# EAGLE design Osmofl2k_adapter_bandpass (EAGLE 7.5.0)
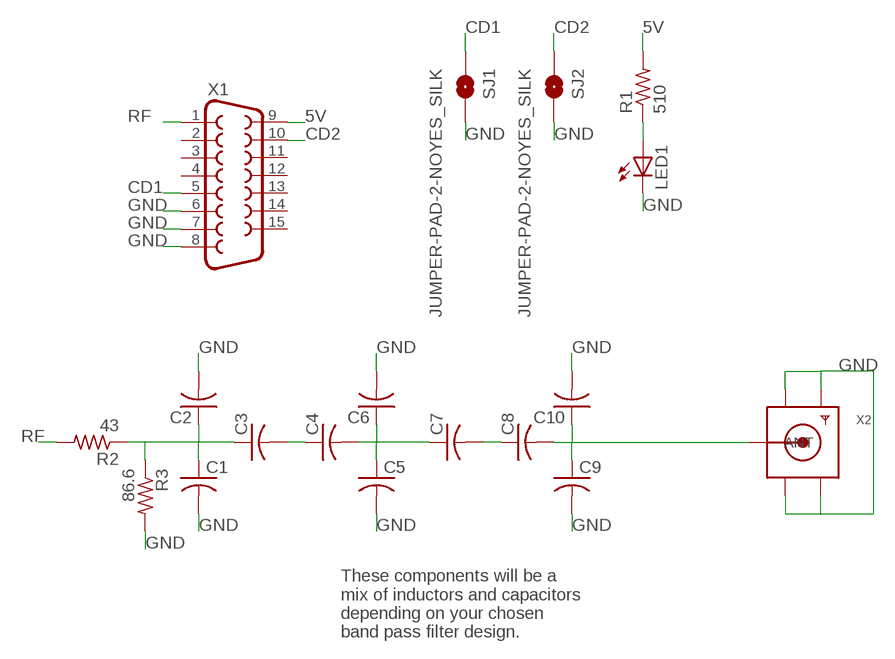
[diagram p0: schematic, sheet 1]

## Parts
C1  C-USC0603  [C0603]
C2  C-USC0402  [C0402]
C3  C-USC0805  [C0805]
C4  C-USC0603  [C0603]
C5  C-USC0603  [C0603]
C6  C-USC0402  [C0402]
C7  C-USC0805  [C0805]
C8  C-USC0603  [C0603]
C9  C-USC0603  [C0603]
C10  C-USC0402  [C0402]
LED1  LEDCHIPLED_0805  [CHIPLED_0805]
R1  510  R-US_R0805  [R0805]
R2  43  R-US_R0805  [R0805]
R3  86.6  R-US_R0805  [R0805]
SJ1  JUMPER-PAD-2-NOYES_SILK  [PAD-JUMPER-2-NO_YES_SILK]
SJ2  JUMPER-PAD-2-NOYES_SILK  [PAD-JUMPER-2-NO_YES_SILK]
X1  F15HDH  [HDF15H]
X2  SMACONNECTOR_EDGE  [SMA_EDGELAUNCH]

## Nets
5V: R1.2 X1.9
CD1: SJ1.1 X1.5
CD2: SJ2.1 X1.10
GND: C1.2 C2.2 C5.2 C6.2 C9.2 C10.2 LED1.C R3.2 SJ1.2 SJ2.2 X1.6 X1.7 X1.8 X2.GND@1(GND4) X2.GND@2(GND3) X2.GND@3(GND2) X2.GND@4(GND1)
N$1: C4.2 C5.1 C6.1 C7.1
N$2: LED1.A R1.1
N$3: C3.2 C4.1
N$4: C1.1 C2.1 C3.1 R2.1 R3.1
N$7: C7.2 C8.1
N$8: C8.2 C9.1 C10.1 X2.P(ANT)
RF: R2.2 X1.1
Unconnected: X1.2 X1.3 X1.4 X1.11 X1.12 X1.13 X1.14 X1.15

## Notes on the sheet
- These components will be a
  mix of inductors and capacitors
  depending on your chosen
  band pass filter design.

## Library data of the parts
C1-C10 = adafruit:C-US: CAPACITOR, American symbol
LED1 = adafruit:LED: LED OSRAM: - CHIPLED LG R971, LG N971, LY N971, LG Q971, LY Q971, LO R971, LY R971 LH N974, LH R974 LS Q976, LO Q976, LY Q976 LO Q996 - Hyper CHIPLED LW Q18S LB Q993, LB Q99A, LB R99A - SideLED LS A670, LO A670, LY A670, LG A670, LP A670 LB A673, LV A673, LT A673, LW A673 LH A674 LY A675 LS A676, LA A676, LO A676, LY A676, LW A676 LS A679, LY A679, LG A679 - Hyper Micro SIDELED® LS Y876, LA Y876, LO Y876, LY Y876 LT Y87S - SmartLED LW L88C, LW L88S LB L89C, LB L89S, LG L890 LS L89K, LO L89K, LY L89K LS L896, LA L896, LO L896, LY L896 - TOPLED LS T670, LO T670, LY T670, LG T670, LP T670 LSG T670, LSP T670, LSY T670, LOP T670, LYG T670 LG T671, LOG T671, LSG T671 LB T673, LV T673, LT T673, LW T673 LH T674 LS T676, LA T676, LO T676, LY T676, LB T676, LH T676, LSB T676, LW T676 LB T67C, LV T67C, LT T67C, LS T67K, LO T67K, LY T67K, LW E67C LS E67B, LA E67B, LO E67B, LY E67B, LB E67C, LV E67C, LT E67C LW T67C LS T679, LY T679, LG T679 LS T770, LO T770, LY T770, LG T770, LP T770 LB T773, LV T773, LT T773, LW T773 LH T774 LS E675, LA E675, LY E675, LS T675 LS T776, LA T776, LO T776, LY T776, LB T776 LHGB T686 LT T68C, LB T68C - Hyper Mini TOPLED® LB M676 - Mini TOPLED Santana® LG M470 LS M47K, LO M47K, LY M47K Source: http://www.osram.convergy.de/
R1-R3 = adafruit:R-US_: RESISTOR, American symbol
SJ1 SJ2 = SparkFun-Passives:JUMPER-PAD-2-NO
X1 = adafruit:F15: SUB-D HDH is also known as a 'right angle VGA' connector
X2 = adafruit:SMACONNECTOR: SMA Connector 90° DIP SMA Connector, 50 Ohm (4UConnector: 07259)

## Board
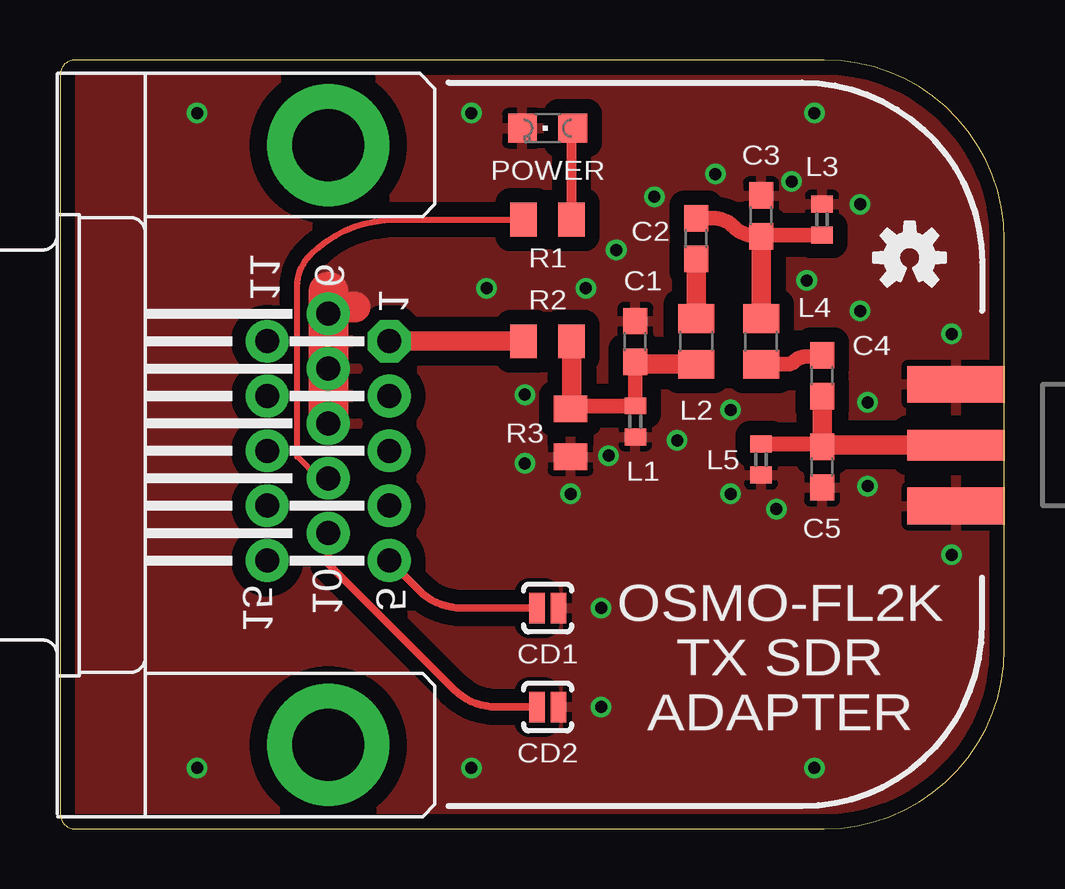
[diagram p1: board, top side]
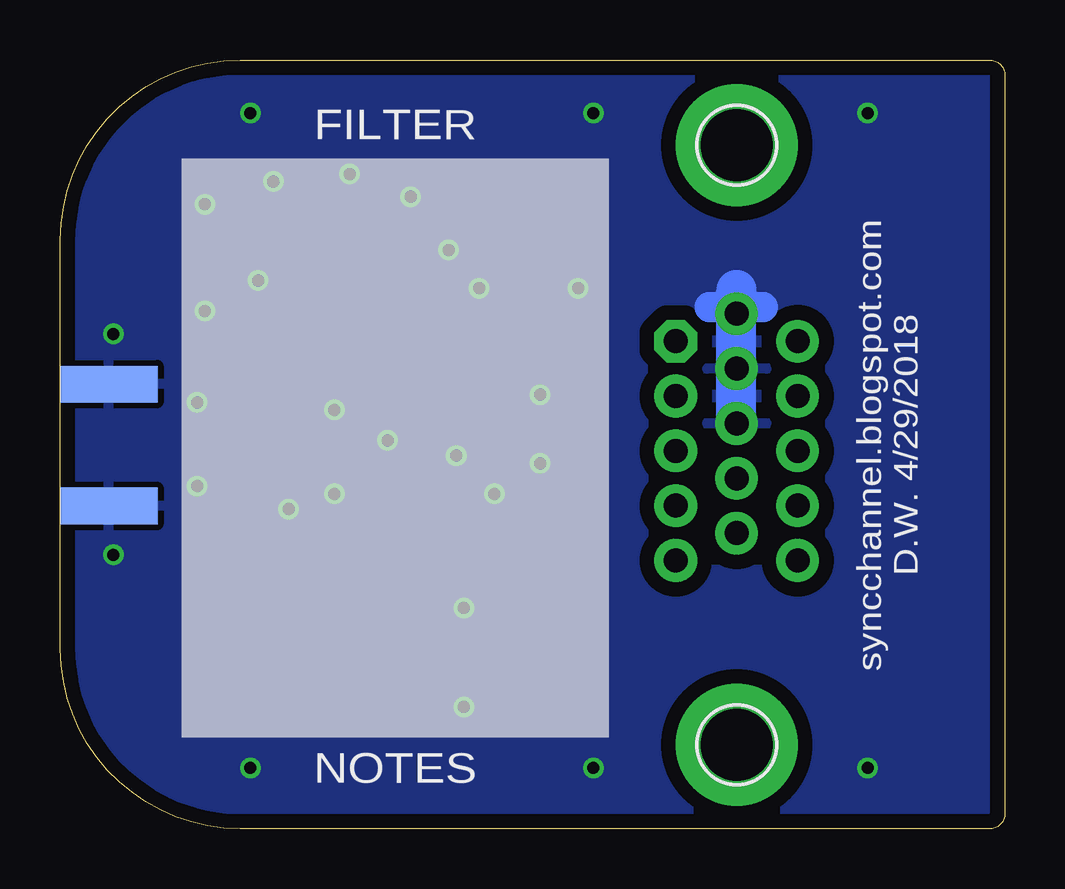
[diagram p2: board, bottom side, seen from below]

Size 39.35 x 32.05 mm. Coordinates in mm from the lower left corner, seen from the top.
Outline: 0,31.42 0,0.64 arc90 0.64,0 31.85,0 arc90 39.35,7.5 39.35,24.55 arc90 31.85,32.05 0.64,32.05 arc90 0,31.42
Copper layers (1*16): Top 0.0356mm / dielectric 1.5011mm / Bottom 0.0356mm
Design rules "LaenPCBOrder *": minimum track width 6mil, minimum drill 13mil, track to track 6mil, track to pad 6mil, pad to pad 6mil, via to via 6mil, smd to smd 6mil, copper to edge 15mil, drill to drill 6mil, minimum pad ring 7mil, minimum via ring 7mil, stop-mask expansion 3mil, vias tented up to drill 20mil, thermal gap 10mil

### Footprints (pad centres in the part's own frame; a part is rotated, then mirrored left to right if it is on the bottom)
C0603 = smd 1.1 x 1: 1 -0.85,0; 2 0.85,0
C0402 = smd 0.7 x 0.9: 1 -0.65,0; 2 0.65,0
C0805 = smd 1.2 x 1.5: 1 -0.95,0; 2 0.95,0
CHIPLED_0805 = smd 1.2 x 1.2: A 0,-1.05; C 0,1.05
R0805 = smd 1.1 x 1.4: 1 -1,0; 2 1,0
PAD-JUMPER-2-NO_YES_SILK = smd 0.635 x 1.27: 1 -0.45,0; 2 0.45,0
HDF15H = drill 1 pad 1.778 octagon: 1 4.329,2.54 | drill 1 pad 1.778: 2 2.043,2.54; 3 -0.243,2.54; 4 -2.529,2.54; 5 -4.815,2.54; 6 5.472,0; 7 3.186,0; 8 0.9,0; 9 -1.386,0; 10 -3.672,0; 11 4.329,-2.54; 12 2.043,-2.54; 13 -0.243,-2.54; 14 -2.529,-2.54; 15 -4.815,-2.54 | drill 3 pad 5.08: P$1 -12.5,0; P$2 12.5,0
SMA_EDGELAUNCH = smd 4.064 x 1.524: GND@1 2.032,-2.54; GND@2 2.032,2.54 | smd 4.064 x 1.524 bottom: GND@3 2.032,2.54; GND@4 2.032,-2.54 | smd 4.064 x 1.27: P 2.032,0

### Placement (x,y rotation side)
C1  23.97,20.32 90 top
C2  23.97,16.99 270 top
C3  26.51,20.32 90 top
C4  26.51,24.61 90 top
C5  29.21,25.56 90 top
C6  31.75,25.4 90 top
C7  29.21,20.32 270 top
C8  31.75,18.89 270 top
C9  31.75,15.08 270 top
C10  29.21,15.4 270 top
LED1  20.32,29.21 90 top
R1  20.32,25.4 180 top
R2  20.32,20.32 180 top
R3  21.27,16.51 270 top
SJ1  20.32,9.21 0 top
SJ2  20.32,5.08 0 top
U$1  [OSHW-LOGO-S]  35.4,23.81 0 top
X1  11.18,16 90 bottom
X2  39.37,16 180 top

### Tracks (layer width: path | path; a pad name or v marks a point on that pad's centre or on a via)
5V
  Top 0.254: X1.9 10.78,14.62 9.88,15.52 9.88,22.59 arc-45 10.44,23.94 arc-45 13.98,25.4 R1.2
CD1
  Top 0.305: SJ1.1 16.75,9.21 arc-45 14.95,9.95 X1.5
CD2
  Top 0.305: X1.10 11.18,11.05 16.4,5.82 arc45 18.2,5.08 SJ2.1
GND  (via drill 0.5)
  Top 0.254: 12.3,21.75 11.18,21.67 X1.6
  Top 1.27: 12.3,21.75 11.67,21.75
  Top 1.676: 11.19,16.91 11.19,22.38
  Bottom 0.254: X1.6 11.03,21.47 11.03,21.75
  Bottom 1.27: 10.08,21.75 11.03,21.75 12.3,21.75
  Bottom 1.676: 11.19,16.99 11.19,22.46
  other vias: 22.54,9.21 22.54,5.08 17.14,29.84 19.37,18.1 19.37,15.24 21.27,13.97 25.72,16.19 27.94,17.46 21.91,22.54 23.18,24.13 24.77,26.35 17.78,22.54 27.3,27.3 30.48,26.99 33.34,26.04 31.11,22.86 33.66,17.78 33.34,21.59 33.66,14.29 29.84,13.34 37.15,20.64 37.15,11.43 22.86,15.56 27.94,13.97 31.43,2.54 31.43,29.84 17.14,2.54 5.71,29.84 5.71,2.54
  pour Bottom (isolate 0.61): -10.16,34.29 -10.16,-2.54 49.53,-2.54 49.53,34.29
  pour Top (isolate 0.61): -11.43,35.56 -11.43,-3.81 50.8,-3.81 50.8,35.56
N$1
  Top 0.61: C4.2 27.2,25.46 arc-45 28.1,25.08 28.1,25.08 arc45 29,24.71 C5.1 29.25,24.75 C6.1
  Top 0.813: C5.1 C7.1
N$2
  Top 0.406: R1.1 21.32,29.16 LED1.A
N$3
  Top 0.813: 26.61,21.17 C3.2 C4.1
N$4
  Top 0.61: R3.1 21.4,17.64 C2.1 C1.1
  Top 0.813: R2.1 21.32,17.56 R3.1 | C3.1 24.07,19.37 C1.1
N$7
  Top 0.61: C7.2 30.3,19.37 arc45 30.61,19.5 arc-45 31.06,19.68 31.69,19.68 C8.1
N$8
  Top 0.61: C10.1 31.71,16.05 C9.1
  Top 0.813: C8.2 C9.1 31.82,16 X2.P
RF
  Top 0.813: X1.1 R2.2

### Text on the board
tNames: C3 | L3 | POWER | C2 | R1 | C1 | R2 | L4 | C4 | R3 | L2 | L1 | L5 | C5 | CD1 | OSMO-FL2K / TX SDR / ADAPTER | CD2
bNames: FILTER | syncchannel.blogspot.com / D.W. 4/29/2018 | NOTES